# Altium schematic sheet Ring 4_B.SchDoc
size A; DocumentNumber: 11; SheetNumber: 19; SheetTotal: 30
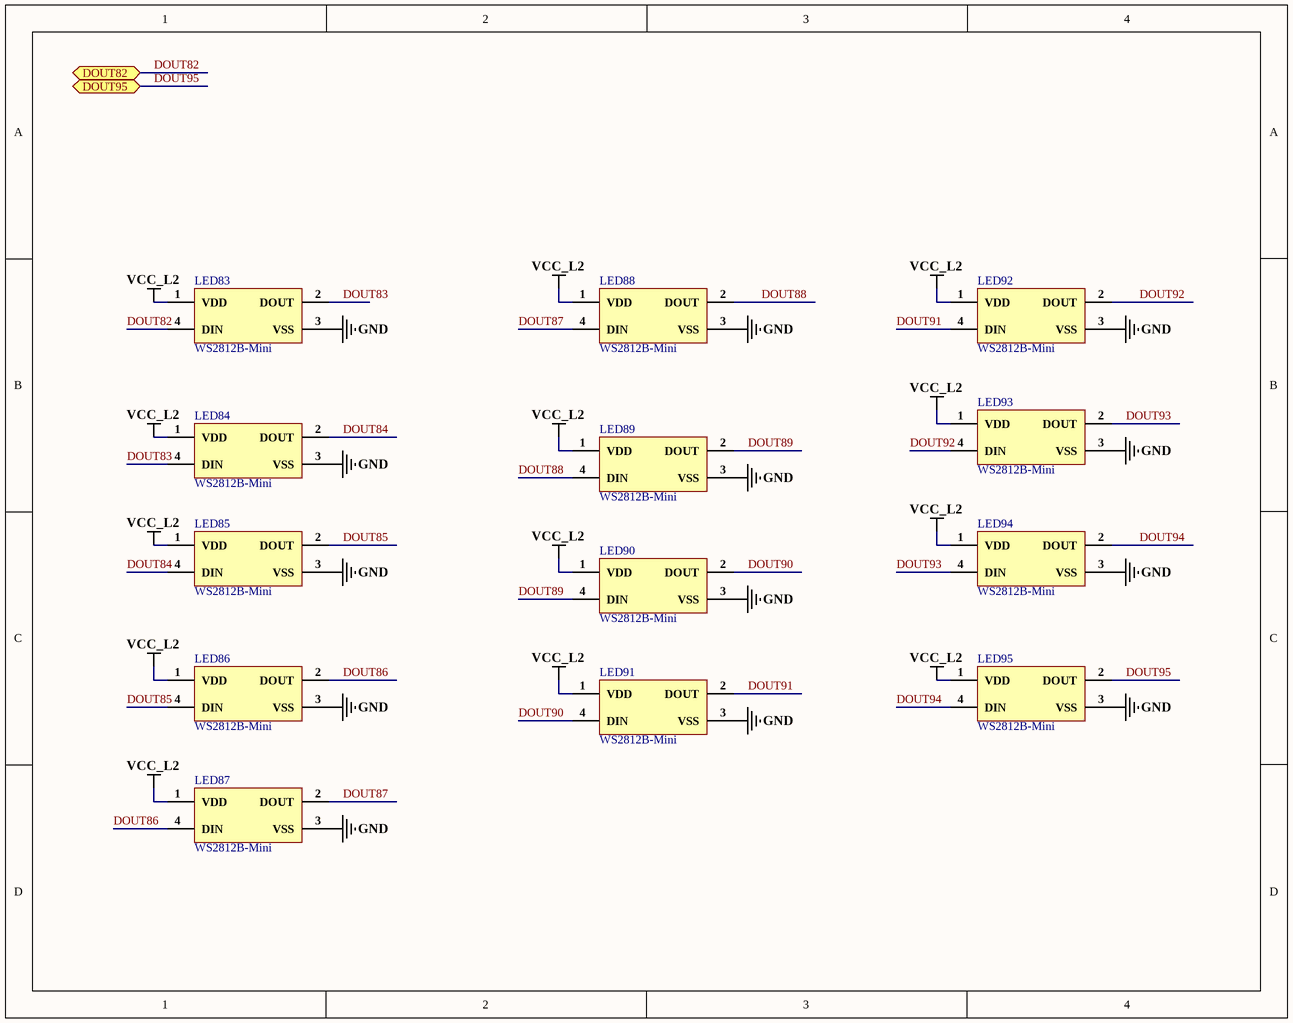
[diagram p0: Ring 4_B.SchDoc]

## Parts
LED83  WS2812B-Mini  [WS2812B-Mini]
LED84  WS2812B-Mini  [WS2812B-Mini]
LED85  WS2812B-Mini  [WS2812B-Mini]
LED86  WS2812B-Mini  [WS2812B-Mini]
LED87  WS2812B-Mini  [WS2812B-Mini]
LED88  WS2812B-Mini  [WS2812B-Mini]
LED89  WS2812B-Mini  [WS2812B-Mini]
LED90  WS2812B-Mini  [WS2812B-Mini]
LED91  WS2812B-Mini  [WS2812B-Mini]
LED92  WS2812B-Mini  [WS2812B-Mini]
LED93  WS2812B-Mini  [WS2812B-Mini]
LED94  WS2812B-Mini  [WS2812B-Mini]
LED95  WS2812B-Mini  [WS2812B-Mini]

## Ports
DOUT82 (bidir), DOUT95 (bidir)

## Nets
GND: LED83.3(VSS) LED84.3(VSS) LED85.3(VSS) LED86.3(VSS) LED87.3(VSS) LED88.3(VSS) LED89.3(VSS) LED90.3(VSS) LED91.3(VSS) LED92.3(VSS) LED93.3(VSS) LED94.3(VSS) LED95.3(VSS)
VCC_L2: LED83.1(VDD) LED84.1(VDD) LED85.1(VDD) LED86.1(VDD) LED87.1(VDD) LED88.1(VDD) LED89.1(VDD) LED90.1(VDD) LED91.1(VDD) LED92.1(VDD) LED93.1(VDD) LED94.1(VDD) LED95.1(VDD)
DOUT82: LED83.4(DIN) ; port DOUT82
DOUT83: LED83.2(DOUT) LED84.4(DIN)
DOUT84: LED84.2(DOUT) LED85.4(DIN)
DOUT85: LED85.2(DOUT) LED86.4(DIN)
DOUT86: LED86.2(DOUT) LED87.4(DIN)
DOUT87: LED87.2(DOUT) LED88.4(DIN)
DOUT88: LED88.2(DOUT) LED89.4(DIN)
DOUT89: LED89.2(DOUT) LED90.4(DIN)
DOUT90: LED90.2(DOUT) LED91.4(DIN)
DOUT91: LED91.2(DOUT) LED92.4(DIN)
DOUT92: LED92.2(DOUT) LED93.4(DIN)
DOUT93: LED93.2(DOUT) LED94.4(DIN)
DOUT94: LED94.2(DOUT) LED95.4(DIN)
DOUT95: LED95.2(DOUT) ; port DOUT95

## Library data of the parts
LED83-LED95 = WS2812B-Mini: SMD,3.5x3.5mm Light Emitting Diodes (LED) RoHS; Manufacturer: Worldsemi; ComponentLink1Description: LCSC; ComponentLink1URL: *https://lcsc.com/product-detail/Light-Emitting-Diodes-LED_Worldsemi-WS2812B-Mini_C527089.html; Package: SMD,3.5x3.5mm; Parameter 1: *